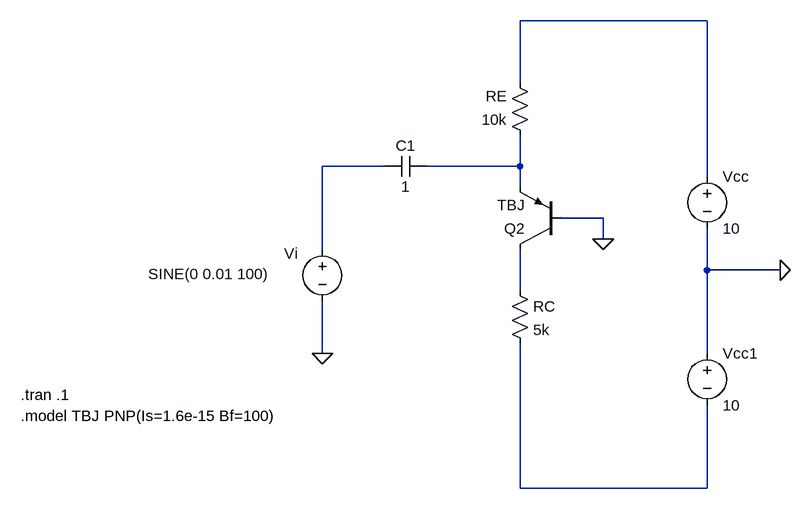
[diagram p0: schematic TBJ - Pequenos Sinais - Exemplo 3.asc]
TBJ - Pequenos Sinais - Exemplo 3.asc, the LTspice schematic file:
Version 4
SHEET 1 880 680
WIRE 496 -96 208 -96
WIRE 208 0 208 -96
WIRE 0 128 -96 128
WIRE 208 128 208 80
WIRE 208 128 64 128
WIRE 496 144 496 -96
WIRE 208 160 208 128
WIRE 336 208 272 208
WIRE 336 240 336 208
WIRE -96 256 -96 128
WIRE 496 288 496 224
WIRE 608 288 496 288
WIRE 208 320 208 256
WIRE -96 416 -96 336
WIRE 496 416 496 288
WIRE 208 624 208 400
WIRE 496 624 496 496
WIRE 496 624 208 624
FLAG -96 416 0
FLAG 608 288 0
FLAG 336 240 0
SYMBOL res 224 96 R180
WINDOW 0 36 76 Left 2
WINDOW 3 36 40 Left 2
SYMATTR InstName RE
SYMATTR Value 10k
SYMBOL voltage -96 240 R0
WINDOW 3 -268 54 Left 2
WINDOW 123 0 0 Left 0
WINDOW 39 0 0 Left 0
WINDOW 0 -59 22 Left 2
SYMATTR Value SINE(0 0.01 100)
SYMATTR InstName Vi
SYMBOL voltage 496 128 R0
SYMATTR InstName Vcc
SYMATTR Value 10
SYMBOL voltage 496 400 R0
SYMATTR InstName Vcc1
SYMATTR Value 10
SYMBOL pnp 272 256 R180
SYMATTR InstName Q2
SYMATTR Value TBJ
SYMBOL res 192 304 R0
SYMATTR InstName RC
SYMATTR Value 5k
SYMBOL cap 64 112 R90
WINDOW 0 0 32 VBottom 2
WINDOW 3 32 32 VTop 2
SYMATTR InstName C1
SYMATTR Value 1
TEXT -560 512 Left 2 !.model TBJ PNP(Is=1.6e-15 Bf=100)
TEXT -560 480 Left 2 !.tran .1

The netlist it stands for:
* TBJ - Pequenos Sinais - Exemplo 3.asc
RE N003 N001 10k
Vi N002 0 SINE(0 0.01 100)
Vcc N001 0 10
Vcc1 0 N005 10
Q2 N004 0 N003 0 TBJ
RC N004 N005 5k
C1 N003 N002 1
.model NPN NPN
.model PNP PNP
.lib standard.bjt
.model TBJ PNP(Is=1.6e-15 Bf=100)
.tran .1
.backanno
.end